# Altium schematic sheet Power.SchDoc
size A
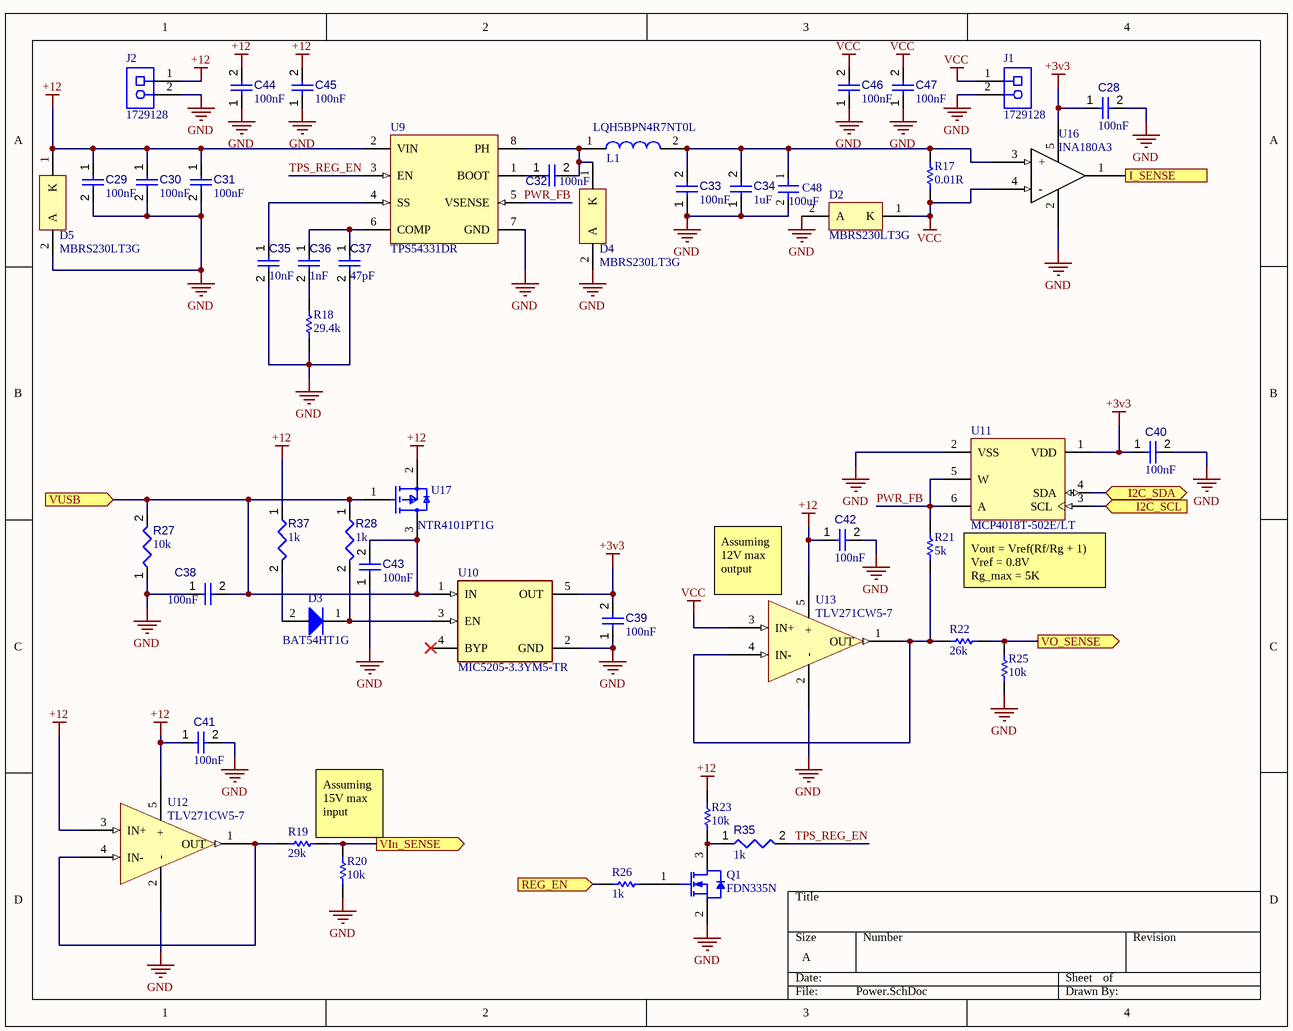
[diagram p0: Power.SchDoc]

## Parts
C28  value 100nF  [CAPC2013X95X50ML10T25]  (hidden comment: Capacitor 100 nF +/-10% 50 V 0805)
C29  value 100nF  [CAPC2013X95X50ML10T25]  (hidden comment: Capacitor 100 nF +/-10% 50 V 0805)
C30  value 100nF  [CAPC2013X95X50ML10T25]  (hidden comment: Capacitor 100 nF +/-10% 50 V 0805)
C31  value 100nF  [CAPC2013X95X50ML10T25]  (hidden comment: Capacitor 100 nF +/-10% 50 V 0805)
C32  value 100nF  [CAPC2013X95X50ML10T25]  (hidden comment: Capacitor 100 nF +/-10% 50 V 0805)
C33  value 100nF  [CAPC2013X95X50ML10T25]  (hidden comment: Capacitor 100 nF +/-10% 50 V 0805)
C34  value 1uF  [CAPC2013X95X50ML10T25]  (hidden comment: Capacitor 100 nF +/-10% 50 V 0805)
C35  value 10nF  [CAPC2013X95X50ML10T25]  (hidden comment: Capacitor 100 nF +/-10% 50 V 0805)
C36  value 1nF  [CAPC2013X95X50ML10T25]  (hidden comment: Capacitor 100 nF +/-10% 50 V 0805)
C37  value 47pF  [CAPC2013X95X50ML10T25]  (hidden comment: Capacitor 100 nF +/-10% 50 V 0805)
C38  value 100nF  [CAPC2013X95X50ML10T25]  (hidden comment: Capacitor 100 nF +/-10% 50 V 0805)
C39  value 100nF  [CAPC2013X95X50ML10T25]  (hidden comment: Capacitor 100 nF +/-10% 50 V 0805)
C40  value 100nF  [CAPC2013X95X50ML10T25]  (hidden comment: Capacitor 100 nF +/-10% 50 V 0805)
C41  value 100nF  [CAPC2013X95X50ML10T25]  (hidden comment: Capacitor 100 nF +/-10% 50 V 0805)
C42  value 100nF  [CAPC2013X95X50ML10T25]  (hidden comment: Capacitor 100 nF +/-10% 50 V 0805)
C43  value 100nF  [CAPC0805(2012)145_L]  (hidden comment: Capacitor 100µF +/-20% 6.3V 0805)
C44  value 100nF  [CAPC2013X95X50LL10T25]  (hidden comment: Capacitor 100 nF +/-10% 50 V 0805)
C45  value 100nF  [CAPC2013X95X50LL10T25]  (hidden comment: Capacitor 100 nF +/-10% 50 V 0805)
C46  value 100nF  [CAPC2013X95X50LL10T25]  (hidden comment: Capacitor 100 nF +/-10% 50 V 0805)
C47  value 100nF  [CAPC2013X95X50LL10T25]  (hidden comment: Capacitor 100 nF +/-10% 50 V 0805)
C48  100uF  [CKG57NX7S1C107M-Footprint-1]
D2  MBRS230LT3G  [ONSC-SMB-2-403A-03_D_V]
D3  BAT54HT1G  [ONSC-SOD-323-2-477-02_V]
D4  MBRS230LT3G  [ONSC-SMB-2-403A-03_D_V]
D5  MBRS230LT3G  [ONSC-SMB-2-403A-03_D_V]
J1  1729128  [PHOE-1729128-2_V]
J2  1729128  [PHOE-1729128-2_V]
L1  LQH5BPN4R7NT0L  [LQH5BPN4R7NT0L-Footprint-1]
Q1  FDN335N  [FAIR-SSOT3L-3_V]
R17  value 0.01R  [RESC3216X60X45ML15T20]  (hidden comment: Resistor 0R +/- 5% 1206 250 mW)
R18  value 29.4k  [RESC2013X50X35ML15T15]  (hidden comment: Resistor 0R +/- 1% 0805 125 mW)
R19  value 29k  [RESC2013X50X35ML15T15]  (hidden comment: Resistor 0R +/- 1% 0805 125 mW)
R20  value 10k  [RESC2013X50X35ML15T15]  (hidden comment: Resistor 0R +/- 1% 0805 125 mW)
R21  value 5k  [RESC2013X50X35ML15T15]  (hidden comment: Resistor 0R +/- 1% 0805 125 mW)
R22  value 26k  [RESC2013X50X35ML15T15]  (hidden comment: Resistor 0R +/- 1% 0805 125 mW)
R23  value 10k  [RESC2013X50X35ML15T15]  (hidden comment: Resistor 0R +/- 1% 0805 125 mW)
R25  value 10k  [RESC2013X50X35ML15T15]  (hidden comment: Resistor 0R +/- 1% 0805 125 mW)
R26  value 1k  [RESC2013X50X35ML15T15]  (hidden comment: Resistor 0R +/- 1% 0805 125 mW)
R27  value 10k  [RESC2013X50X35ML15T15]  (hidden comment: Resistor 10k +/-1% 0805 125 mW)
R28  value 1k  [RESC2013X50X35ML15T15]  (hidden comment: Resistor 10k +/-1% 0805 125 mW)
R35  value 1k  [RESC2013X50X35ML15T15]  (hidden comment: Resistor 10k +/-1% 0805 125 mW)
R37  value 1k  [RESC2013X50X35ML15T15]  (hidden comment: Resistor 10k +/-1% 0805 125 mW)
U9  TPS54331DR  [D0008A_L]
U10  MIC5205-3.3YM5-TR  [FP-M5-IPC_C]
U11  MCP4018T-502E/LT  [SC70-LT6_L]
U12  TLV271CW5-7  [SOT95P285X130-5N]
U13  TLV271CW5-7  [SOT95P285X130-5N]
U16  INA180A3  [SOT95P245X110-5N]
U17  NTR4101PT1G  [FP-318-08-MFG]

## Ports
I2C_SCL (in), I2C_SDA (bidir), I_SENSE (out), REG_EN (in), VIn_SENSE (out), VO_SENSE (out), VUSB (in)

## Nets
+3v3: C28.1 C39.2 C40.1 U10.5(OUT) U11.1(VDD) U16.5(Vcc)
+12: C29.1 C30.1 C31.1 C41.1 C42.1 C44.2 C45.2 D5.1(K) J2.1 R23.2 R37.1 U9.2(VIN) U12.3(IN+) U12.5(+) U13.5(+) U17.2(Source)
GND: C28.2 C29.2 C30.2 C31.2 C33.1 C34.1 C35.2 C37.2 C38.1 C39.1 C40.2 C41.2 C42.2 C43.1 C44.1 C45.1 C46.1 C47.1 C48.2 D2.2(A) D4.2(A) D5.2(A) J1.2 J2.2 Q1.2(S) R18.2 R20.1 R25.1 R27.1 U9.7(GND) U10.2(GND) U11.2(VSS) U12.2(-) U13.2(-) U16.2(GND)
VCC: C46.2 C47.2 D2.1(K) J1.1 R17.1 U13.3(IN+) U16.4(-)
I2C_SCL: U11.3(SCL) ; port I2C_SCL
I2C_SDA: U11.4(SDA) ; port I2C_SDA
I_SENSE: U16.1(out) ; port I_SENSE
PWR_FB: R21.2 U9.5(VSENSE) U11.5(W) U11.6(A)
REG_EN: R26.1 ; port REG_EN
TPS_REG_EN: R35.2 U9.3(EN)
VIn_SENSE: R19.2 R20.2 ; port VIn_SENSE
VO_SENSE: R22.2 R25.2 ; port VO_SENSE
VUSB: C38.2 C43.2 R27.2 R28.1 U10.1(IN) U17.1(Gate) U17.3(Drain) ; port VUSB
NetC32_1: C32.1 U9.1(BOOT)
NetC32_2: C32.2 D4.1(K) L1.1 U9.8(PH)
NetC33_2: C33.2 C34.2 C48.1 L1.2 R17.2 U16.3(+)
NetC35_1: C35.1 U9.4(SS)
NetC36_1: C36.1 C37.1 U9.6(COMP)
NetC36_2: C36.2 R18.1
NetD3_1: D3.1(K) R28.2 U10.3(EN)
NetD3_2: D3.2(A) R37.2
NetQ1_1: Q1.1(G) R26.2
NetQ1_3: Q1.3(D) R23.1 R35.1
NetR19_1: R19.1 U12.1(OUT) U12.4(IN-)
NetR21_1: R21.1 R22.1 U13.1(OUT) U13.4(IN-)

Not connected (* = marked no-connect by the designer): U10 4(BYP)*

## Notes on the sheet
- (near U13) Assuming 12V max output
- Vout = Vref(Rf/Rg + 1)
  Vref = 0.8V
  Rg_max = 5K
- (near R19) Assuming 15V max input

## Library data of the parts
C28-C42 = CMP-001-00018-4: Chip Capacitor, 100 nF, +/- 10%, 50 V, 0805 (2012 Metric); Voltage Rating: 50V; Capacitor Type: Ceramic; RoHS Compliant: True; Max Operating Temperature: 125°C; Mounting Technology: SM; Case/Package: 0805; Tolerance: 10%; Min Operating Temperature: -55°C; Pins: 2
C43 = CMP-001-00054-3: Chip Capacitor, 100µF +/-20%, 6.3V, 0805, Thickness 1.45 mm; Tolerance: 10%; Pins: 2; Mounting Technology: SMT; Case/Package: 0805; Min Operating Temperature: -55°C; Voltage Rating: 6.3V; Max Operating Temperature: 85°C
C44-C47 = CMP-001-00018-5: Chip Capacitor, 100 nF, +/- 10%, 50 V, 0805 (2012 Metric); Capacitor Type: Ceramic; Voltage Rating: 50V; Tolerance: 10%; RoHS Compliant: True; Mounting Technology: SM; Max Operating Temperature: 125°C; Pins: 2; Case/Package: 0805; Min Operating Temperature: -55°C
C48 = CMP-001-00083-2: 100uF 16V Stacked MLCC / CKG57NX7S1C107M
D2 D4 D5 = CMP-1055-00336-1: Schottky Power Rectifier, 2-Pin SMB, Pb-Free, Tape and Reel; Manufacturer: On Semiconductor; IFSM Max (A): 40; Configuration: Single; ComponentLink1URL: http://www.onsemi.com/; DatasheetVersion: Rev. 3; PartNumber: MBRS230LT3G; Packing: Tape and Reel; PackageReference: SMB-2-403A-03_D; ComponentLink3URL: http://www.onsemi.cn/pub_link/Collateral/MBRS230LT3-D.PDF; ComponentLink1Description: Manufacturer URL; ComponentLink3Description: Package Specification; ComponentLink2Description: Datasheet; Mounting Technology: Surface Mount; PackageVersion: Rev. D; RoHS: TRUE; PackageDescription: 2-Pin Small Molded Package, J-Bend Lead, Body 4.315 x 3.555 mm; ComponentLink2URL: http://www.onsemi.cn/pub_link/Collateral/MBRS230LT3-D.PDF
D3 = CMP-1055-00462-1: Schottky Barrier Diode, 2-Pin SOD-323, Pb-Free, Tape and Reel; Manufacturer: On Semiconductor; Configuration: Single; trr Max (ns): 5; IFSM Max (A): 0.6; ComponentLink3URL: http://www.onsemi.com/pub_link/Collateral/477-02.PDF.1; PackageDescription: 2-Pin SOD, Body 1.7 x 1.25 mm; ComponentLink2URL: http://www.onsemi.cn/pub_link/Collateral/BAT54HT1-D.PDF; ComponentLink3Description: Package Specification; ComponentLink2Description: Datasheet; DatasheetVersion: Rev. 6; PackageReference: SOD-323-2-477-02; RoHS: TRUE; ComponentLink1URL: http://www.onsemi.com/; Packing: Tape and Reel; PartNumber: BAT54HT1G; Mounting Technology: Surface Mount; ComponentLink1Description: Manufacturer URL; PackageVersion: Rev. H, 03/2007
J1 J2 = CMP-2000-05815-1: PCB Terminal Block, 13.5 A, 400 V, 2-Pin THD, RoHS, Bulk; Manufacturer: Phoenix Contact; Package Version: 03/2015; No. of Rows: 1; Pitch: 5.08mm; No. of Positions: 2; Voltage Rating: 400V; Current Rating: 13500mA; Manufacturer URL: http://www.phoenixcontact.com/; Datasheet URL: https://datasheet.ciiva.com/16046/1729128-16046181.pdf; RoHS: TRUE; Package URL: https://www.phoenixcontact.com/online/portal/pi/pxc/product_detail_page/!ut/p/b1/3VdJjqNKFDxLH8AFycySyWY2ozFsEPOMMQaDOX1XedGL_1Vdm5YXJleknhSKeBkvI6EA8ncAo3AYoDhBQGco6KN7VURTdemj9us_IEKEZo_YHiPAEWEFmDGOHMORkqKYCORBZxgL7ZoaZYcbFFUZ3fqxSY6GOuxydWUuHqz1ynmMFygu583Bob0Ewr6Sd_l-5m-kAueHiB0jpRwZwe58wwtkpxtMYd_LmGcDRU02dRNEyWt6Y2ti5pSyJ_reIkzIulrqApdnbT11V5jnCKbYNCvhEM1MCpPByat_X379-iThf08CI5GfOPqfBeS3BRoBOdD55AKVv0iLwCMq-2BrzXWSGRH7pUGD9uwXQjiph3xL0DKQwdGa0JImiIOmBNOestqgwTHSSs2oOep-78apyXQBvNi8ZLaFjvjWvcaUEBu0MC6Wbe-d6mB0FAebo2lUWinqYaZs5DAYzV0RP9yitUjnGJ0iI9xhZkT42OCQNUJJhkgWINNQLP2JFP6OpMg3JCVg70jqHT0lvKOnhHf0lPuOnnLf0VPuWx6_dxwUIvwk5WMkT0kLL1mh61l2yZVSzG3pYV_bqo-mj6uMKwKwdnnW8Jh5RTOJzMOA5c-eJDaZQw4mTMPH02PvS_ZAqNVjVTo2WyYLkwH_KU1mmmG5kjRhDqPXLwwVHvVOjCM60-fpXvTDfMGW1PVFVS1r4e4yVDk4ZdNbkUHvqPqQSeian4UD39fNKmachqdJ1NJbyk8rXT9mXTvPk3oE5meulKGgiruPJek-4I9hTT6G8ZLOyRSm2RRVbThERQad5OS28hdt4YW4vG0stgYYzsWsK4_7y6DZMjJSCqri1kyiZR5vD7pwIrNR7QwPHTcLTI5qT7eRlpHrdGiupYlqQDJ7zy_CND8fWWBoLRXxk1RVcXiBQwbTD4Xi7KL-FuO94t9xaqweXzH; PartNumber: 1729128; Package Description: 2-Pin Through Hole Device, Body 8.1 x 10.16 mm, Pitch 5.08 mm; Datasheet Version: 12/2013; Mounting Technology: ThroughHole; Orientation: Horizontal; Package Reference: 1729128-2; Packing: Bulk
L1 = CMP-006-00021-2: 4.7uH 2A 58mOhm 5x5mm inductor Murata; Datasheet: https://datasheet.lcsc.com/szlcsc/1912111437_Murata-Electronics-LQH5BPN4R7NT0L_C171792.pdf
Q1 = CMP-2000-06249-1: N-Channel Specified PowerTrench(R) MOSFET, 2.5 V, 1.7 A, -55 to 150 degC, 3-Pin SSOT3L, RoHS, Tape and Reel; Manufacturer: FairchildSemiconductor; RDS-on: 0.07@4.5VOhm; Typical Fall Time: 3ns; Maximum Drain Source Voltage: 20V; Rad Hard: No; Channel Mode: Enhancement; Package Version: Rev. 3, 05/2015; Maximum Gate Source Voltage: ±8V; Typical Rise Time: 8.5ns; Typical Turn-Off Delay Time: 11ns; Maximum Continuous Drain Current: 1.7A; Channel Type: N; Typical Turn-On Delay Time: 5ns; Packaging: Tape&Reel; Mounting Technology: SurfaceMount; Mounting: SurfaceMount; Manufacturer URL: https://www.fairchildsemi.com/; Datasheet URL: https://www.fairchildsemi.com/datasheets/FD/FDN335N.pdf; Package Description: 3-Pin Small Outline Transistor, Body 2.92 x 1.4 mm, Pitch 0.95 mm; Package URL: https://www.fairchildsemi.com/package-drawings/MA/MA03B.pdf; Datasheet Version: Rev. C, 04/1999; Package Reference: SSOT3L; Package: 3SuperSOT; Operating Temperature: -55to150°C; Category: MOSFET
R17 = CMP-009-00002-4: Chip Resistor, 0 Ohm, +/- 5%, 0.25 W, -55 to 155 degC, 1206 (3216 Metric); Voltage Rating: 200V; Power: 250mW; Case/Package: 1206; Mounting Technology: SM; RoHS Compliant: True; Min Operating Temperature: -55°C; Max Operating Temperature: 155°C; Tolerance: 5%; Pins: 2
R18-R23 R25 R26 = CMP-009-00001-4: Chip Resistor, 0 Ohm, +/- 1%, 125 mW, -55 to 155 degC, 0805 (2012 Metric); Power: 125mW; Voltage Rating: 150V; Tolerance: 1%; Mounting Technology: SM; Min Operating Temperature: -55°C; Case/Package: 0805; Pins: 2; Max Operating Temperature: 155°C; RoHS Compliant: True
R27 R28 R35 R37 = CMP-009-00018-4: Chip Resistor, 10 KOhm, +/- 1%, 125 mW, -55 to 155 degC, 0805 (2012 Metric); Power: 125mW; Voltage Rating: 150V; RoHS Compliant: True; Mounting Technology: SM; Pins: 2; Case/Package: 0805; Min Operating Temperature: -55°C; Max Operating Temperature: 155°C; Tolerance: 1%
U9 = CMP-0323-00209-3: Buck Step Down Regulator with 3.5 to 28 V Input and 0.8 to 25 V Output, -40 to 150 degC, 8-Pin SOIC (D), Green (RoHS & no Sb/Br); Manufacturer: Texas Instruments; Vin(Max)(V): 28; Duty Cycle(Max)(%): 90; Vin(Min)(V): 3.5; Iq(Typ)(mA): 0.11; SubFamily: Step-Down Regulator; Rating: Catalog; Iout(Max)(A): 3; Regulated Outputs(#): 1; Vout(Max)(V): 25; Vout(Min)(V): 0.8; Code_JEDEC: MS-012AA; DatasheetVersion: SLVS839D; ComponentLink3Description: URL Link1; Topology: Buck; ComponentLink2URL: http://www.ti.com/litv/pdf/msoi002j; Eco-Plan: Green (RoHS & no Sb/Br); ComponentLink1URL: http://www.ti.com/general/docs/lit/getliterature.tsp?genericPartNumber=TPS54331&fileType=pdf; Mounting Technology: Surface Mount; PartNumber: TPS54331DR; ComponentLink3URL: Samples URL:http://www.ti.com/product/tps54331#samples; ComponentLink1Description: Datasheet; PackageVersion: revM, Jun-2011; ComponentLink2Description: Package Specification; PackageDescription: 8-Pin Plastic Small Outline Integrated Circuit, 4.9 x 3.9 mm, Pitch 1.27 mm Pitch; Switch Current Limit(Typ)(A): 3.5; PackageReference: D0008A
U10 = CMP-06324-000014-1: IC REG LINEAR 3.3V 150MA SOT23-5; Manufacturer: Microchip; Number Of Outputs: 1; Output Type: Fixed; Min Supply Voltage: 2.5V; Accuracy Percentage: 2%; Dropout Voltage: 165mV; Max Supply Voltage: 16V; Max Junction Temp: +125°C; Standoff Height: 0mm; Digikey Description: IC REG LINEAR 3.3V 150MA SOT23-5; Output Current: 150mA; Temperature: -40°C to +125°C; Temperature Range High: +125°C; Height: 1.45mm; ComponentLink2URL: http://ww1.microchip.com/downloads/en/DeviceDoc/20005785A.pdf; Mouser Description: LDO Voltage Regulators; Device Class L3: Voltage Regulators - Linear; Package: M5; Temperature Range Low: -40°C; Device Class L1: Integrated Circuits (ICs); ComponentLink2Description: Datasheet; Automotive: No; Ipc Land Pattern Name: SOT95P280X118-5; Octopart: https://octopart.com/mic5205-3.3ym5-tr-microchip-66802130; Device Class L2: Power Management ICs; Manufacturer Part Number: MIC5205-3.3YM5-TR; Lead Free: Yes; RoHS: TRUE
U11 = CMP-0188-00771-2: 7-Bit Single I2C Digital POT with Volatile Memory, 6-pin SC70, Extended Temperature, Tape and Reel; PackageDescription: 6-Lead Plastic Small Outline Transistor (LT) [SC70]; DatasheetVersion: revA, Mar-2009; ComponentLink1URL: http://www.microchip.com/; ComponentLink1Description: Manufacturer URL; ComponentLink3Description: Package Specification; ComponentLink3URL: http://www.microchip.com/stellent/groups/techpub_sg/documents/packagingspec/en012702.pdf; ComponentLink2Description: Datasheet; PackageVersion: revBB, Aug-2009; ComponentLink2URL: http://ww1.microchip.com/downloads/en/DeviceDoc/22147a.pdf; PackageReference: SC70-LT6; RevisionNote: URLs added.
U12 U13 = CMP-014-00003-1: IC OPAMP GP 3MHZ RRO SOT25
U16 = CMP-014-00002-1: Current Sense Amplifier 100V/V; ComponentLink1Description: Datasheet; ComponentLink1URL: https://datasheet.lcsc.com/szlcsc/1811151640_Texas-Instruments-INA180A3IDBVR_C122882.pdf
U17 = CMP-1058-00754-2: MOSFET P-CH 20V 1.8A SOT-23; Threshold Voltage: -720mV; Rise Time: 12.6ns; Turn-Off Delay Time: 30.2ns; Voltage Rating (DC): -20V; Input Capacitance: 675pF; Power Dissipation: 730mW; Current Rating: -3.2A; Turn-On Delay Time: 7.5ns; Gate to Source Voltage (Vgs): 8V; Element Configuration: Single; Number of Elements: 1; On-State Resistance: 70MR; Rds On Max: 85mR; Drain to Source Resistance: 112mR; Height: 0.94mm; Min Operating Temperature: -55°C; Lead Free: Lead Free; Fall Time: 12.6ns; Nominal Vgs: -720mV; REACH SVHC: No SVHC; Number of Pins: 3; Contact Plating: Tin; Case/Package: SOT-23-3; Radiation Hardening: No; Length: 2.9mm; Width: 1.3mm; Package Quantity: 1; Max Operating Temperature: 150°C; Drain to Source Breakdown Voltage: -20V; Max Power Dissipation: 730mW; Packaging: Tape and Reel; Drain to Source Voltage (Vdss): 20V; Continuous Drain Current (ID): -3.2A